# Altium schematic sheet BusRCServo.SchDoc
size A; SheetNumber: 6; SheetTotal: 8
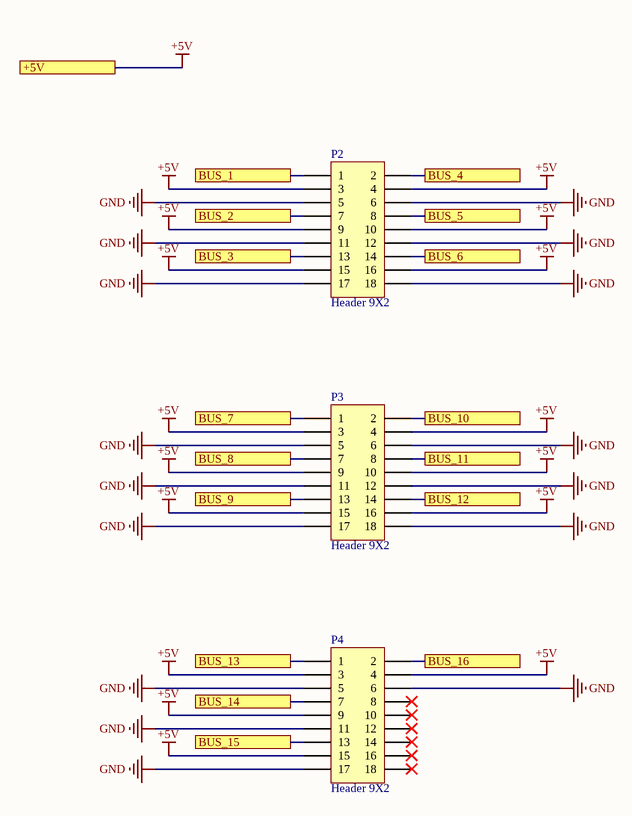
[diagram p0: BusRCServo.SchDoc]

## Parts
P2  Header 9X2  [HDR2X9]
P3  Header 9X2  [HDR2X9]
P4  Header 9X2  [HDR2X9]

## Ports
+5V, BUS_1, BUS_2, BUS_3, BUS_4, BUS_5, BUS_6, BUS_7, BUS_8, BUS_9, BUS_10, BUS_11, BUS_12, BUS_13, BUS_14, BUS_15, BUS_16

## Nets
+5V: P2.3 P2.4 P2.9 P2.10 P2.15 P2.16 P3.3 P3.4 P3.9 P3.10 P3.15 P3.16 P4.3 P4.4 P4.9 P4.15 ; port +5V
GND: P2.5 P2.6 P2.11 P2.12 P2.17 P2.18 P3.5 P3.6 P3.11 P3.12 P3.17 P3.18 P4.5 P4.6 P4.11 P4.17
BUS_1: P2.1 ; port BUS_1
BUS_2: P2.7 ; port BUS_2
BUS_3: P2.13 ; port BUS_3
BUS_4: P2.2 ; port BUS_4
BUS_5: P2.8 ; port BUS_5
BUS_6: P2.14 ; port BUS_6
BUS_7: P3.1 ; port BUS_7
BUS_8: P3.7 ; port BUS_8
BUS_9: P3.13 ; port BUS_9
BUS_10: P3.2 ; port BUS_10
BUS_11: P3.8 ; port BUS_11
BUS_12: P3.14 ; port BUS_12
BUS_13: P4.1 ; port BUS_13
BUS_14: P4.7 ; port BUS_14
BUS_15: P4.13 ; port BUS_15
BUS_16: P4.2 ; port BUS_16

Not connected (* = marked no-connect by the designer): P4 8* 10* 12* 14* 16* 18*

## Library data of the parts
P2-P4 = Header 9X2: Header, 9-Pin, Dual row; LatestRevisionDate: 17-Jul-2002; LatestRevisionNote: Re-released for DXP Platform.; Publisher: Altium Limited